# Altium schematic sheet Controle do Motor.SchDoc: Controle do Motor
size A4; DrawnBy: João Bortolace; Revision: 1.0; SheetNumber: 5; SheetTotal: 6
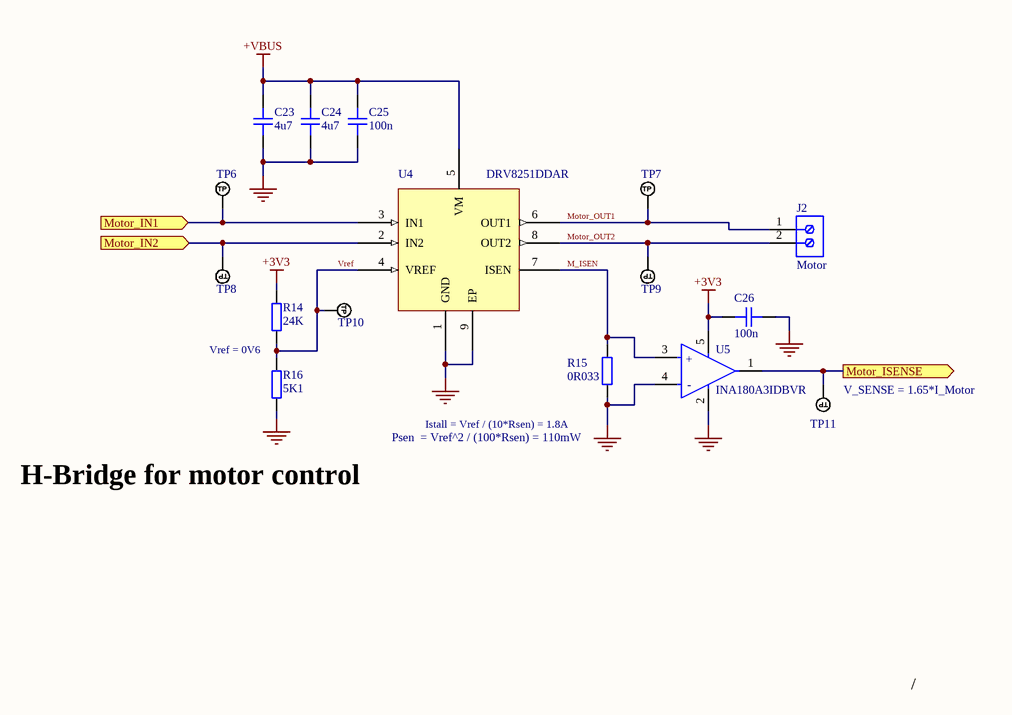
[diagram p0: Controle do Motor.SchDoc]

## Parts
C23  4u7  [CAP_0805]
C24  4u7  [CAP_0805]
C25  100n  [CAP_0402]
C26  100n  [CAP_0402]
J2  Motor  [691102710002]  (no BOM)
R14  24K  [RES_0402]
R15  0R033  [RES_1206]
R16  5K1  [RES_0402]
TP6  TP_NOBOM  [PAD_RND_1MM]  (value not drawn)  (no BOM)
TP7  TP_NOBOM  [PAD_RND_1MM]  (value not drawn)  (no BOM)
TP8  TP_NOBOM  [PAD_RND_1MM]  (value not drawn)  (no BOM)
TP9  TP_NOBOM  [PAD_RND_1MM]  (value not drawn)  (no BOM)
TP10  TP_NOBOM  [PAD_RND_1MM]  (value not drawn)  (no BOM)
TP11  TP_NOBOM  [PAD_RND_1MM]  (value not drawn)  (no BOM)
U4  DRV8251DDAR  [HSOP8]
U5  INA180A3IDBVR  [FP-DBV0005A-MFG]

## Ports
Motor_IN1 (in, see Esquemático Principal[3B]), Motor_IN2 (in, see Esquemático Principal[3B]), Motor_ISENSE (out, see Esquemático Principal[3B])

## Nets
+3V3: C26.2 R14.2 U5.5(VS)
+VBUS: C23.2 C24.2 C25.2 U4.5(VM)
GND: C23.1 C24.1 C25.1 C26.1 R15.1 R16.1 U4.1(GND) U4.9(EP) U5.2(GND) U5.4(IN-)
M_ISEN: R15.2 U4.7(ISEN) U5.3(IN+)
Motor_IN1: TP6.1(TP) U4.3(IN1) ; port Motor_IN1
Motor_IN2: TP8.1(TP) U4.2(IN2) ; port Motor_IN2
Motor_ISENSE: TP11.1(TP) U5.1(OUT) ; port Motor_ISENSE
Motor_OUT1: J2.1 TP7.1(TP) U4.6(OUT1)
Motor_OUT2: J2.2 TP9.1(TP) U4.8(OUT2)
Vref: R14.1 R16.2 TP10.1(TP) U4.4(VREF)

## Notes on the sheet
- Vref = 0V6
- (near R15) Psen  = Vref^2 / (100*Rsen) = 110mW
- (near R15) Istall = Vref / (10*Rsen) = 1.8A
- (near TP11) V_SENSE = 1.65*I_Motor
- H-Bridge for motor control
- /
- (in symbol CMP-04895-000229-1) +; -

## Library data of the parts
C23 C24 = CAP_0805: 4.7uF ±10% 50V Ceramic Capacitor X5R 0805; Manufacturer: Samsung Electro-Mechanics; Manufacturer Part Number: CL21A475KBQNNNE; Distributor Link: https://www.lcsc.com/product-detail/C98192.html?s_z=n_capacitor%25204.7u; LCSC: C98192; Rating: *; Dielectric: *
C25 C26 = CAP_0402: 100nF ±10% 50V Ceramic Capacitor X7R 0402D 0402; Manufacturer: muRata; Manufacturer Part Number: GRM155R71H104KE14D; Distributor Link: https://www.lcsc.com/product-detail/C77020.html; LCSC: C77020; Rating: *; Dielectric: *
J2 = CMP-1502-03258-3: 102 Series 5MM Pitch Straight, Pcb Terminal Block, Through Hole, 2 Way; Current Rating: 15A; Wire/Cable Gauge: 22AWG; Voltage: 300V; Number of Positions Per Level: 2; Plating: Steel; Stripping Length: -6mm; Wire Gauge (Min): 14AWG; Number of Levels: 1; Pitch: 5.0038mm; Width: 11.2mm; Max Operating Temperature: 105°C; Contact Material: Brass; Contact Plating: Tin; Current: 15A; Wire Gauge (Max): 22AWG; Mount: Through Hole; Length: 7.5mm; Min Operating Temperature: -40°C; RoHS: Compliant; Color: Blue; Number of Pins: 2; Housing Material: Nylon; Termination: Screw; Height: 13.4mm; Number of Contacts: 2; Lead Pitch: 5mm; Voltage Rating: 300V; Packaging: Box
R14 R16 = RES_0402: Resistor SMD 0402; Manufacturer: *; Manufacturer Part Number: *; Distributor Link: *; LCSC: *
R15 = RES_1206: 250mW 33mΩ Thick Film Resistor ±1200ppm/℃ ±1% 1206 Chip Resistor - Surface Mount RoHS; Manufacturer: FOJAN; Manufacturer Part Number: FRL1206FR033TS; Distributor Link: https://www.lcsc.com/product-detail/C7467307.html?s_z=n_33m%25CE%25A9%2520; LCSC: C7467307
TP6-TP11 = TEST_POINT_RND_1MM: Test Point Round 1mm (NO BOM)
U4 = DRV8251: 4.1-A Brushed DC Motor Driver with Integrated Current Regulation; Manufacturer: TI; Manufacturer Part Number: DRV8251DDAR; Part Link: https://www.lcsc.com/product-detail/C3681116.html?s_z=n_C3681116; LCSC: C3681116; Mouser: 595-DRV8251DDAR
U5 = CMP-04895-000229-1: IC CURR SENSE 1 CIRCUIT SOT23-5; -3db Bandwidth: 350kHz; Input Bias Current: 100nA; Input Offset Voltage (Vos): 100uV; Operating Supply Current: 260uA; Slew Rate: 2V/µs; Number of Circuits: 1; Max Operating Temperature: 125°C; Packaging: Tape and Reel; Case/Package: SOT-23-5; Mount: Surface Mount; Min Operating Temperature: -40°C; RoHS Compliant: Yes